# Altium schematic sheet 低通&放大.SchDoc
size A4
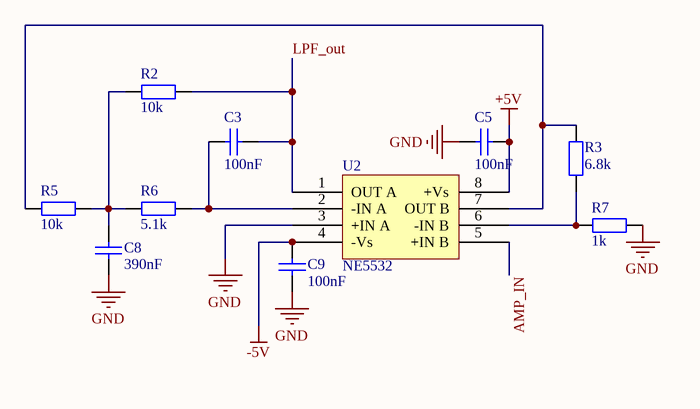
[diagram p0: 低通&放大.SchDoc]

## Parts
C3  100nF  [LC-0805_C]
C5  100nF  [LC-0805_C]
C8  390nF  [LC-0805_C]
C9  100nF  [LC-0805_C]
R2  10k  [LC-0805_R]
R3  6.8k  [LC-0805_R]
R5  10k  [LC-0805_R]
R6  5.1k  [LC-0805_R]
R7  1k  [LC-0805_R]
U2  NE5532  [DIP-8]

## Nets
+5V: C5.2 U2.8(+Vs)
-5V: C9.1 U2.4(-Vs)
GND: C5.1 C8.2 C9.2 R7.2 U2.3(+IN_A)
AMP_IN: U2.5(+IN_B)
LPF_out: C3.2 R2.2 U2.1(OUT_A)
NetC3_1: C3.1 R6.2 U2.2(-IN_A)
NetC8_1: C8.1 R2.1 R5.2 R6.1
NetR3_1: R3.1 R7.1 U2.6(-IN_B)
NetR3_2: R3.2 R5.1 U2.7(OUT_B)

## Library data of the parts
C3 C5 C8 C9 = Cap: 100nF��0805��50V,+/-10%
R2 R3 R5-R7 = R: 10k��,0805,��5%
U2 = NE5532: NE5532��SO-8